# EAGLE design sensor9dof (EAGLE 7.5.0)
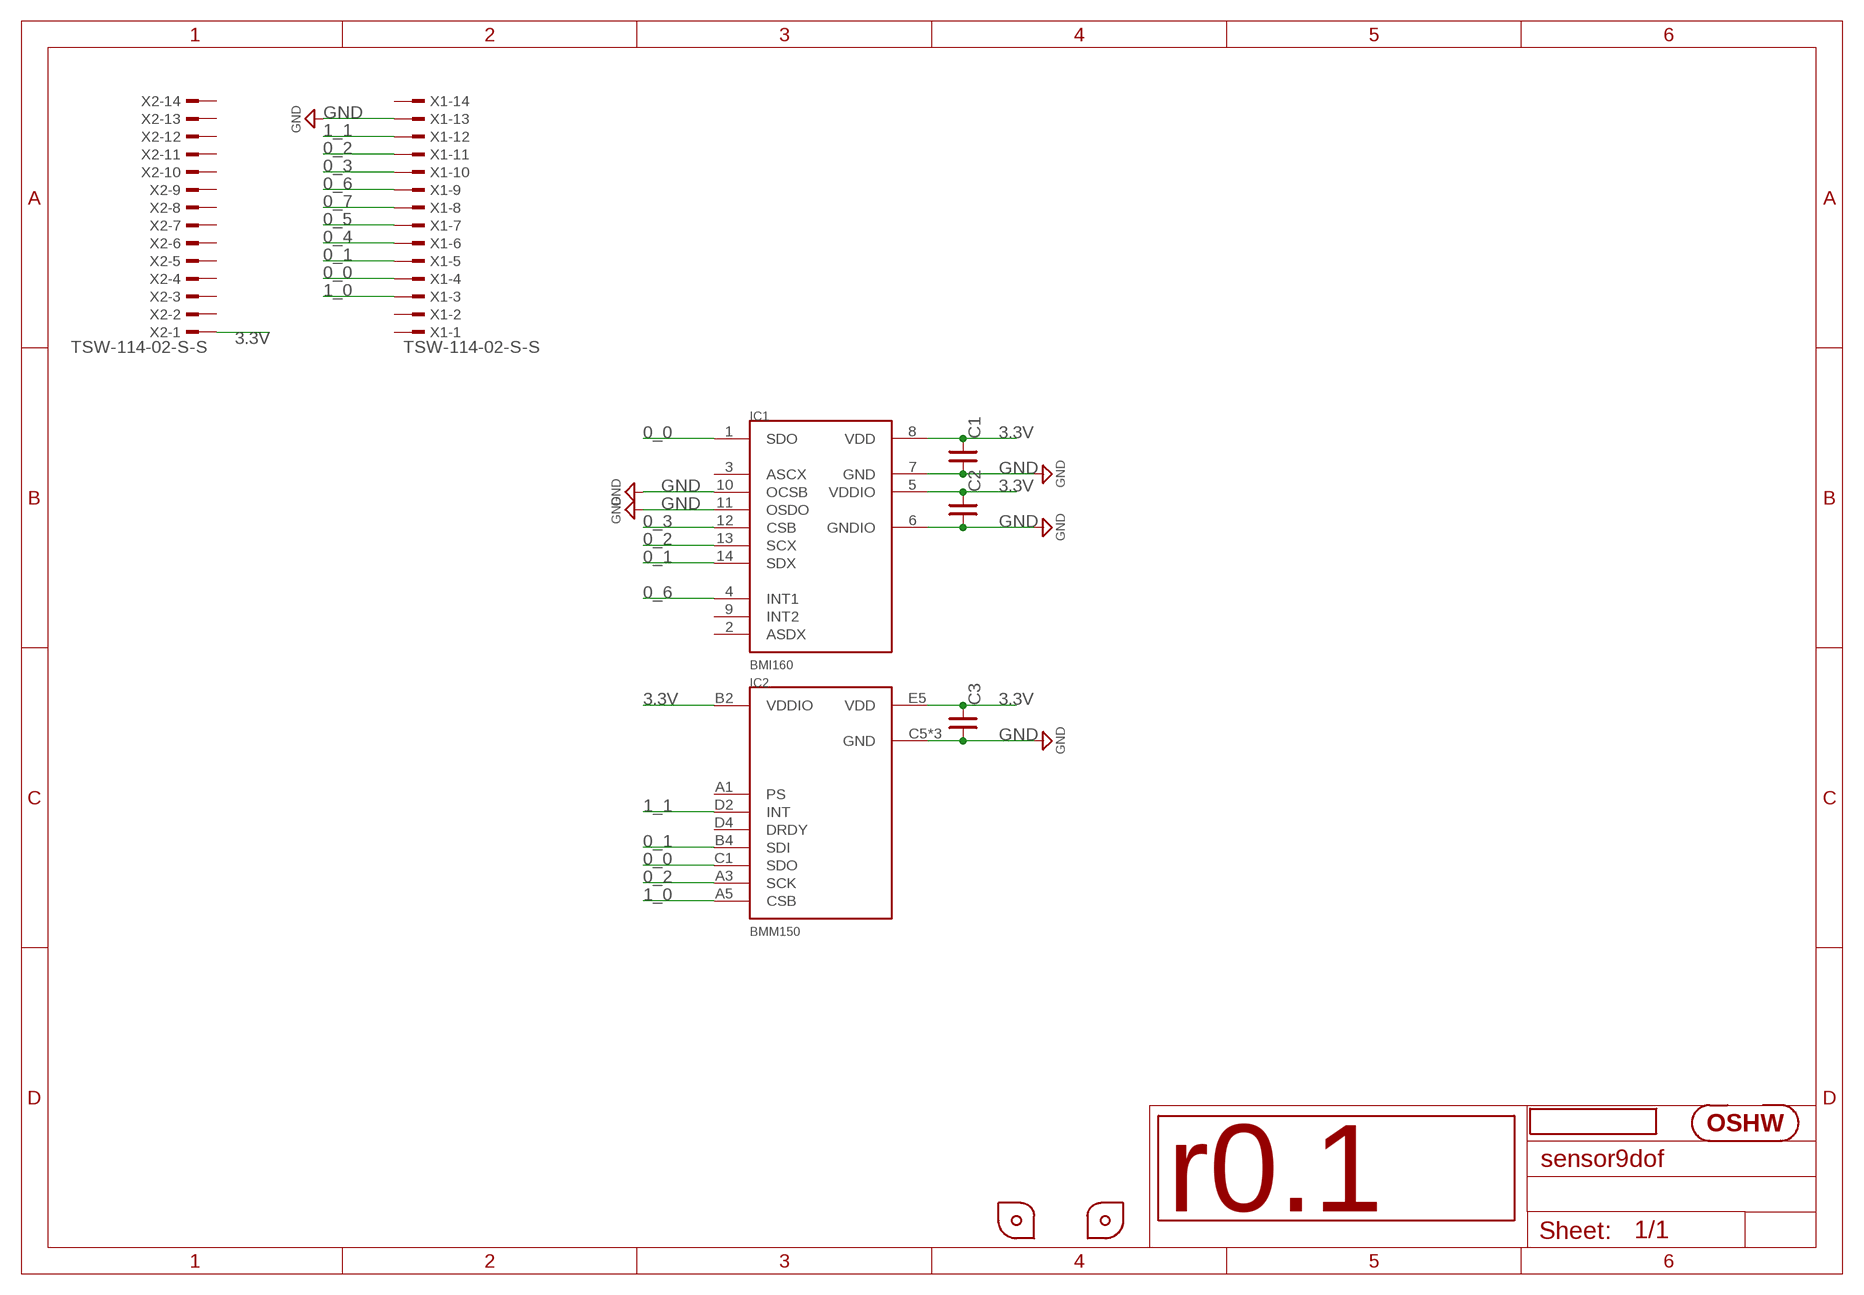
[diagram p0: schematic, sheet 1]

## Parts
C1  C_SMD_0.1U_1005  [C0402]
C2  C_SMD_0.1U_1005  [C0402]
C3  C_SMD_0.1U_1005  [C0402]
GIT1  GIT-REVISION_1.0  [GIT-REVISION]
IC1  BMI160  [BMI160]
IC2  BMM150  [BMM150]
ICON1  ICON_OSHW  [ICON_OSHW]
ICON2  r0.1  ICON_REVISION_2.0  [ICON_REVISION2.0]
P5  PCB_CORNER_NH  [PCB_CORNER_NH]
P6  PCB_CORNER  [PCB_CORNER]
X1  TSW-114-02-S-S  [TSW-114-07-F-S]
X2  TSW-114-02-S-S  [TSW-114-07-F-S]

## Nets
0_0: IC1.1(SDO) IC2.C1(SDO) X1.4
0_1: IC1.14(SDX) IC2.B4(SDI) X1.5
0_2: IC1.13(SCX) IC2.A3(SCK) X1.11
0_3: IC1.12(CSB) X1.10
0_4: X1.6
0_5: X1.7
0_6: IC1.4(INT1) X1.9
0_7: X1.8
1_0: IC2.A5(CSB) X1.3
1_1: IC2.D2(INT) X1.12
3.3V: C1.1 C2.1 C3.1 IC1.5(VDDIO) IC1.8(VDD) IC2.B2(VDDIO) IC2.E5(VDD) X2.1
GND: C1.2 C2.2 C3.2 IC1.6(GNDIO) IC1.7(GND) IC1.10(OCSB) IC1.11(OSDO) IC2.C5(GND) IC2.E1(GND) IC2.E3(GND) X1.13
Unconnected: IC1.2(ASDX) IC1.3(ASCX) IC1.9(INT2) IC2.A1(PS) IC2.D4(DRDY) X1.1 X1.2 X1.14 X2.2 X2.3 X2.4 X2.5 X2.6 X2.7 X2.8 X2.9 X2.10 X2.11 X2.12 X2.13 X2.14

## Library data of the parts
C1-C3 = mylib:C_SMD_*: SMD CAPACITOR; DIGIKEY: 490-3261-1-ND; SEEED: 302010024; SMD_PAD: 2
GIT1 = git-revision:GIT-REVISION; NOT_COMPONENT: YES
IC1 = mylib:BMI160
IC2 = mylib:BMM150
ICON1 = mylib:ICON_OSHW: Silk icon of OSHW; NOT_COMPONENT: YES
ICON2 = mylib:ICON_REVISION; NOT_COMPONENT: YES
P5 P6 = mylib:PCB_CORNER; NOT_COMPONENT: YES
X1 X2 = mylib:TSW-114-02-S-S: THROUGH-HOLE .025inch SQ POST HEADER Source: Samtec TSW.pdf

## Board
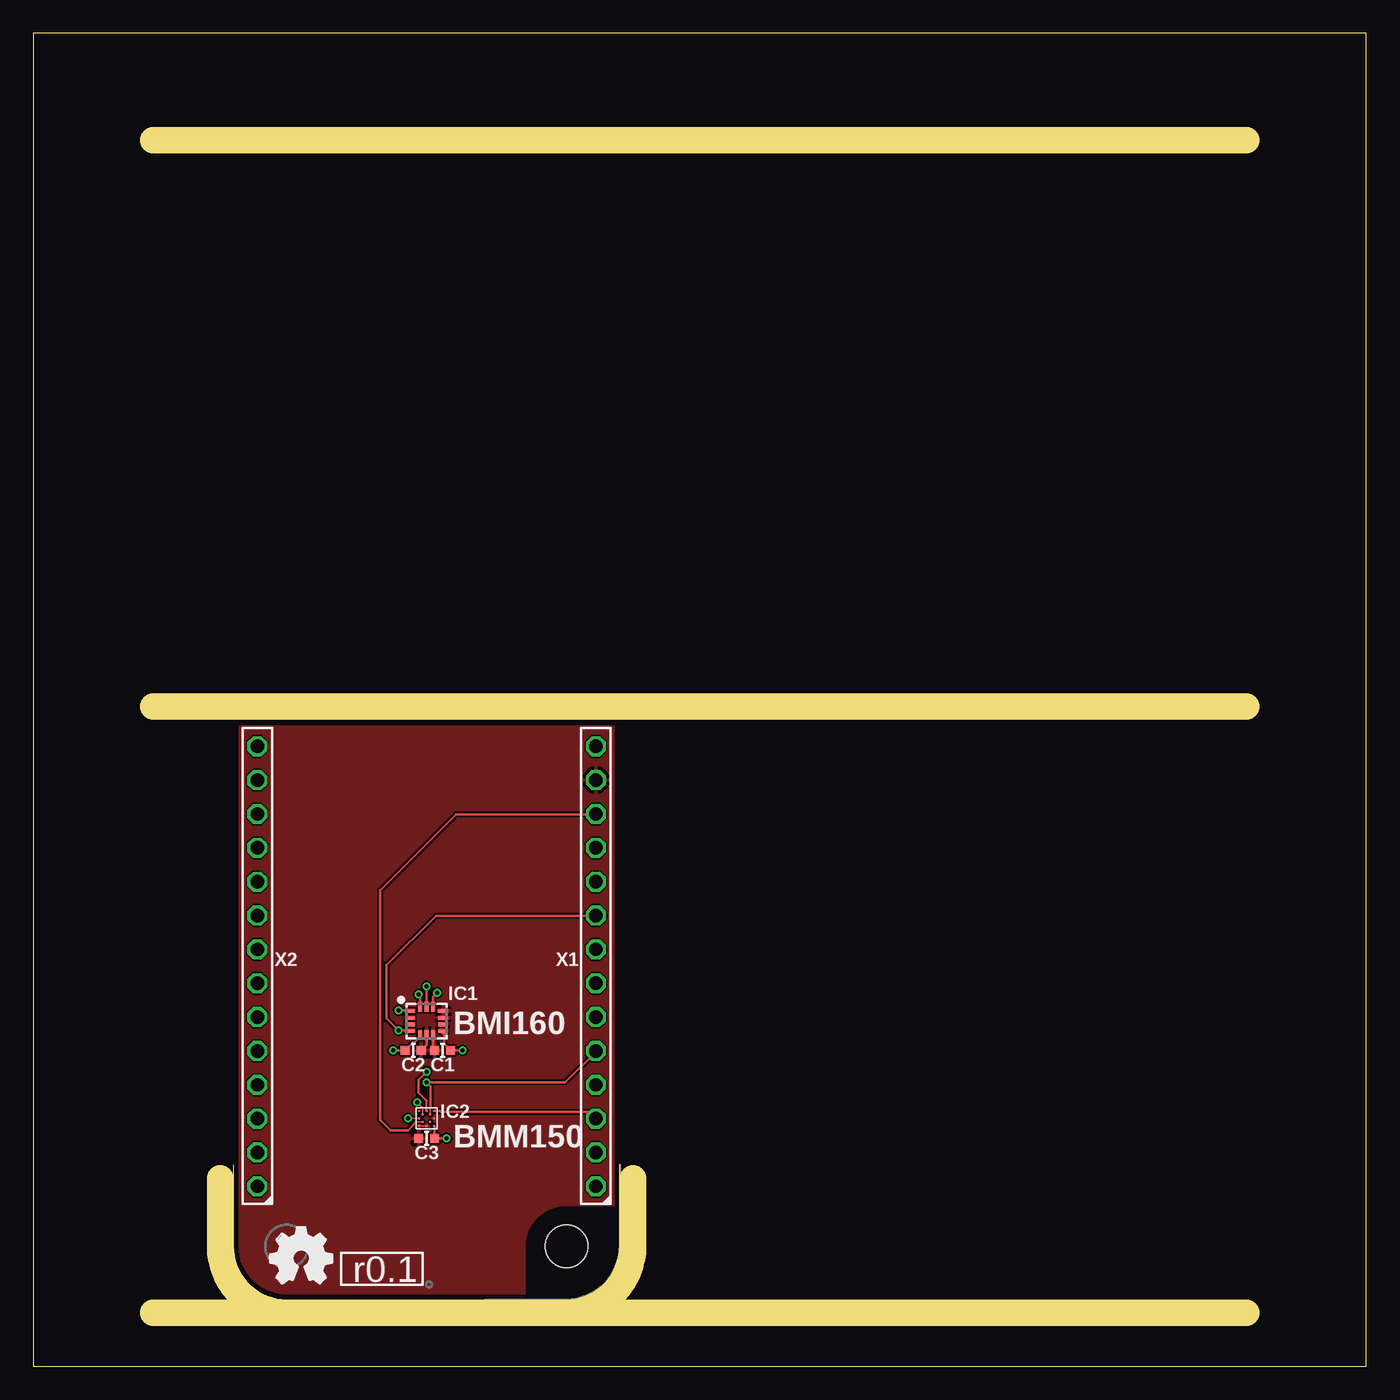
[diagram p1: board, top side]
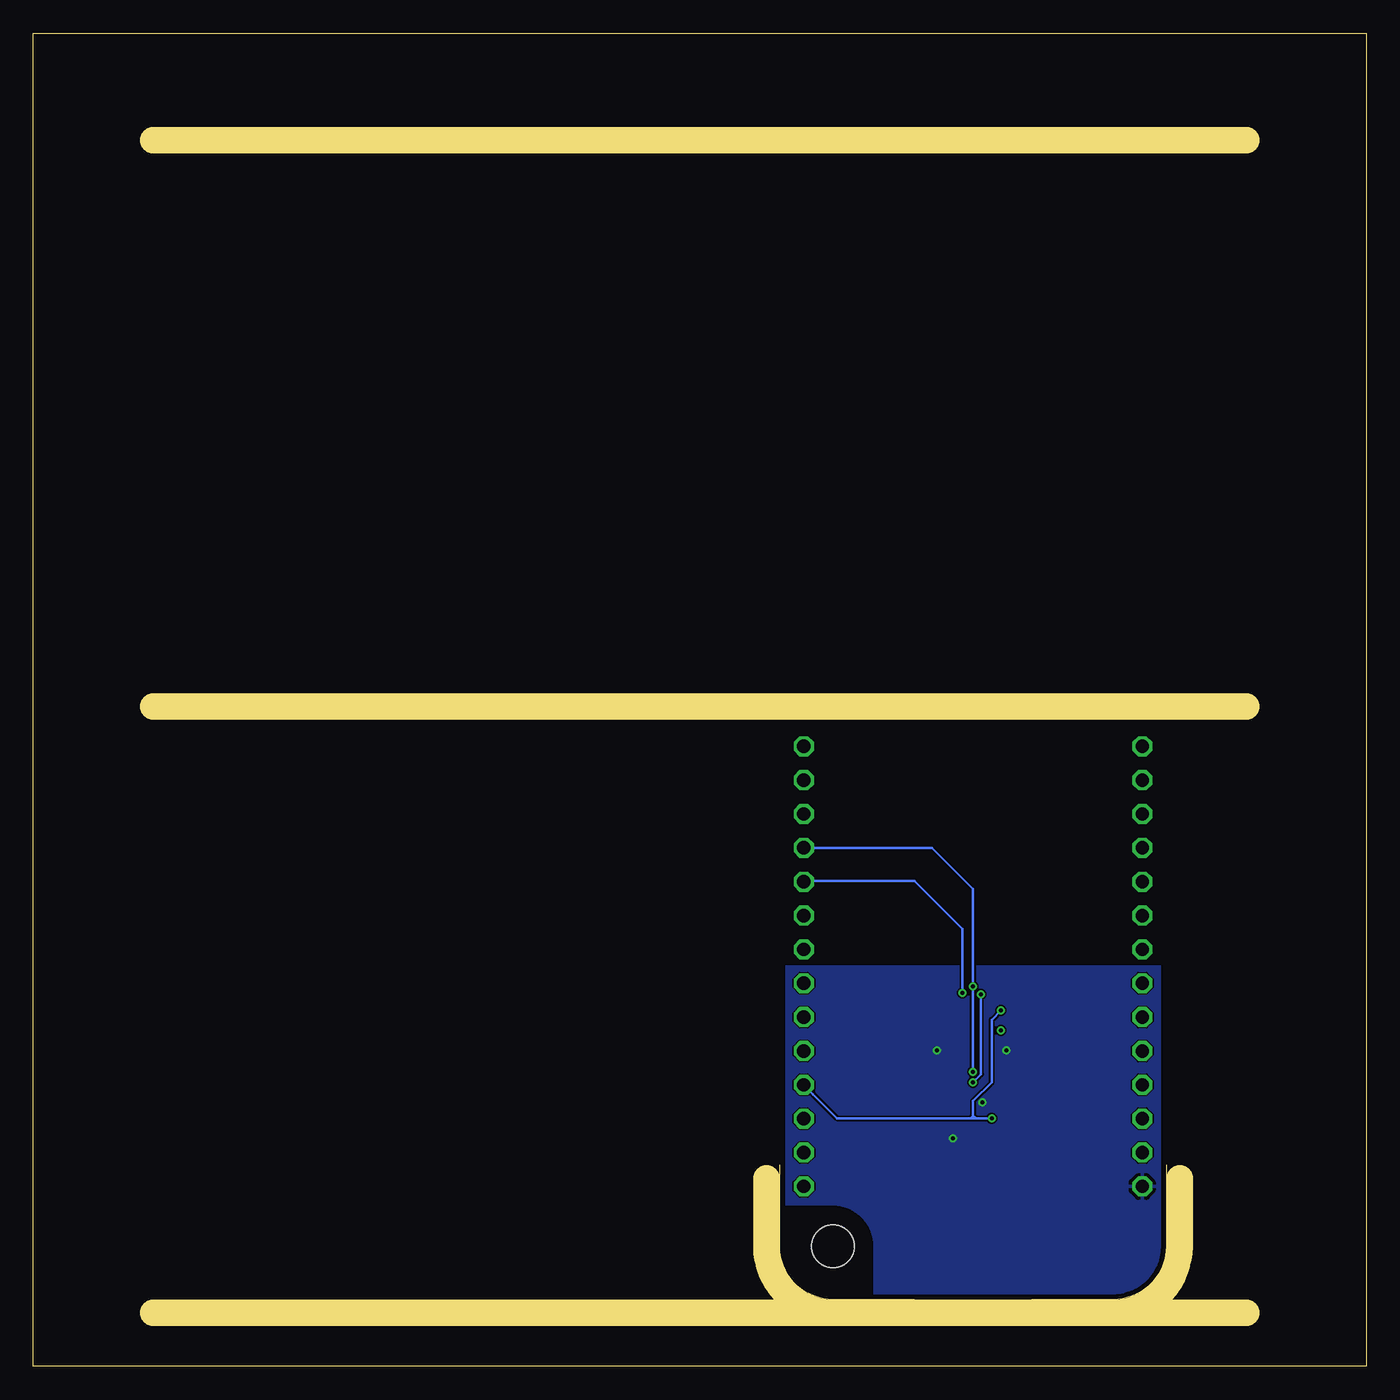
[diagram p2: board, bottom side, seen from below]

Size 100 x 100 mm. Coordinates in mm from the lower left corner, seen from the top.
Outline: 0,0 100,0 100,100 0,100 0,0
Copper layers (1*16): Top 0.035mm / dielectric 1.5mm / Bottom 0.035mm
Design rules "default *": minimum track width 0.15mm, minimum drill 0.3mm, track to track 0.12mm, track to pad 0.12mm, pad to pad 0.12mm, via to via 0.12mm, smd to smd 0.12mm, copper to edge 0.4mm, drill to drill 8mil, minimum pad ring 0.15mm, minimum via ring 0.15mm, stop-mask expansion 4mil, vias tented up to drill 100mil, thermal gap 10mil
tRestrict: 6 lines
bRestrict: 4 lines
Milling: 3 lines

### Footprints (pad centres in the part's own frame; a part is rotated, then mirrored left to right if it is on the bottom)
C0402 = smd 0.7 x 0.7: 1 -0.6,0; 2 0.6,0
BMI160 = smd 0.75 x 0.3: 1 -1.25,0.75; 2 -1.25,0.25; 3 -1.25,-0.25; 4 -1.25,-0.75; 8 1.25,-0.75; 9 1.25,-0.25; 10 1.25,0.25; 11 1.25,0.75 | smd 0.3 x 0.75: 5 -0.5,-1.05; 6 0,-1.05; 7 0.5,-1.05; 12 0.5,1.05; 13 0,1.05; 14 -0.5,1.05
BMM150 = smd 0.2 x 0.2: A1 0.566,0.566; A3 0.566,0; A5 0.566,-0.566; B2 0.283,0.283; B4 0.283,-0.283; C1 0,0.566; C5 0,-0.566; D2 -0.283,0.283; D4 -0.283,-0.283; E1 -0.566,0.566; E3 -0.566,0; E5 -0.566,-0.566
PCB_CORNER = hole 3.2: 0,0
TSW-114-07-F-S = drill 1 pad 1.5 octagon: 1 16.51,0; 2 13.97,0; 3 11.43,0; 4 8.89,0; 5 6.35,0; 6 3.81,0; 7 1.27,0; 8 -1.27,0; 9 -3.81,0; 10 -6.35,0; 11 -8.89,0; 12 -11.43,0; 13 -13.97,0; 14 -16.51,0

### Placement (x,y rotation side)
C1  30.7,23.7 180 top
C2  28.5,23.7 0 top
C3  29.5,17.1 180 top
GIT1  29.71,6.16 0 top
IC1  29.5,25.9 0 top
IC2  29.5,18.6 90 top
ICON1  20.1,8.1 0 top
ICON2  26.4,7.3 0 top
P5  19,9 270 top
P6  40,9 0 top
X1  42.2,30 270 top
X2  16.8,30 270 top

### Tracks (layer width: path | path; a pad name or v marks a point on that pad's centre or on a via)
0_0  (via drill 0.3 pad 0.6)
  Top 0.12: IC2.C1 v28.1,18.6
  Top 0.2: IC1.1 28.05,26.65 28,26.7 v27.4,26.7
  Bottom 0.2: 29.7,18.6 39.7,18.6 41.5,20.4 41.5,20.41 X1.4 | 29.7,18.6 29.5,18.6 | 29.5,18.6 29.3,18.6 | 29.3,18.6 v28.1,18.6 | v27.4,26.7 28.1,26 28.1,21.3 29.5,19.9 29.5,18.8 | 29.5,18.8 29.5,18.6 | 29.5,18.8 29.3,18.6 | 29.5,18.8 29.7,18.6
0_1  (via drill 0.3 pad 0.6)
  Top 0.12: IC2.B4 29.78,19.38
  Top 0.15: 29.78,19.38 29.8,19.4
  Top 0.2: IC1.14 29,27.8 v28.9,27.9 | X1.5 42.2,23.6 39.9,21.3 v29.5,21.3 29.8,21 29.8,19.4
  Bottom 0.2: v29.5,21.3 28.9,21.9 v28.9,27.9
0_2  (via drill 0.3 pad 0.6)
  Top 0.15: IC2.A3 29.5,19.9
  Top 0.2: IC1.13 v29.5,28.5 | 29.5,19.9 28.9,20.5 28.9,21.5 v29.5,22.1
  Bottom 0.2: v29.5,22.1 v29.5,28.5 29.5,35.8 32.6,38.9 X1.11
0_3  (via drill 0.3 pad 0.6)
  Top 0.2: IC1.12 30,27.7 v30.3,28
  Bottom 0.2: v30.3,28 30.3,32.8 33.9,36.4 42.2,36.4 X1.10
0_6  (via drill 0.3 pad 0.6)
  Top 0.2: IC1.4 28.05,25.15 28,25.2 v27.4,25.2 26.5,26.1 26.5,30.1 30.2,33.8 42.9,33.8 42.91,33.81 X1.9
1_0
  Top 0.2: IC2.A5 30.53,19.17 30.6,19.1 41.7,19.1 42.2,18.6 X1.3
1_1
  Top 0.12: IC2.D2 28.72,18.32
  Top 0.2: 28.72,18.32 28.1,17.7 26.8,17.7 26,18.5 26,35.7 31.7,41.4 42.2,41.4 X1.12
3.3V  (via drill 0.3 pad 0.6)
  Top 0.12: IC2.B2 29.22,19.38 29.2,19.4
  Top 0.2: IC1.5 29,24.7 28.6,24.3 28.5,24.3 C2.1 v27,23.7 | v32.2,23.7 C1.1 30.8,24.2 30.8,24.9 | IC1.8 30.8,25.1 30.8,24.9 | 30.8,24.9 30.6,25.1 | 30.8,24.9 31,25.1 | v31,17.1 C3.1 30.1,18 IC2.E5 | v28.8,19.8 29.2,19.4
  pour Bottom: 15,5 15,30 44,30 44,5
GND
  Top 0.12: IC2.E3 IC2.E1
  Top 0.2: IC1.7 30,23.8 C1.2 | IC1.6 29.5,24.1 C2.2
  pour Top: 15,5 15,48.5 44,48.5 44,5

### Text on the board
tPlace: BMI160 | BMM150